# EAGLE schematic NES (EAGLE 9.6.2)
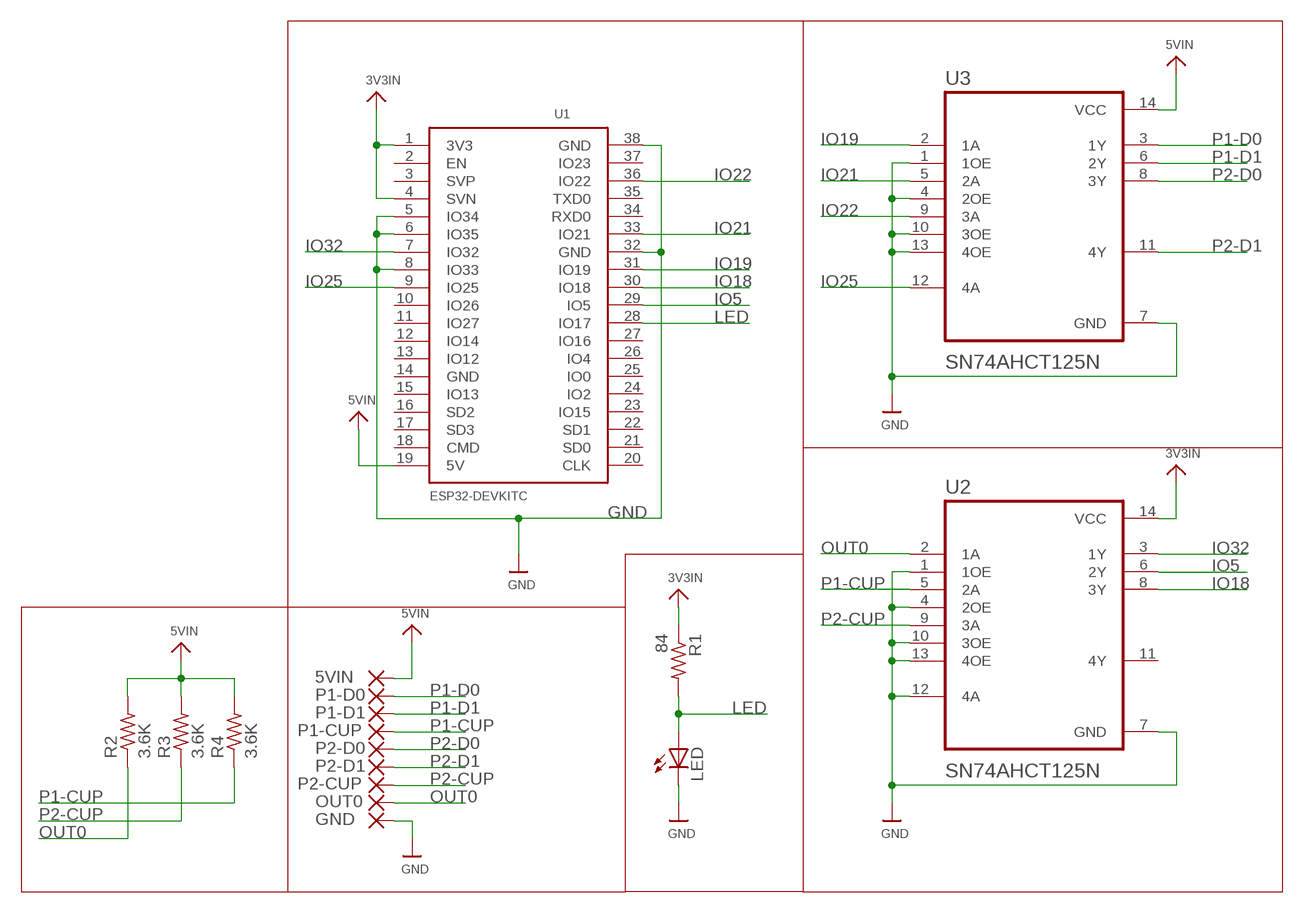
[diagram p0: schematic, sheet 1]

## Parts
5VIN  SMD5  [SMD2,54-5,08]
GND  SMD5  [SMD2,54-5,08]
LED  LEDCHIPLED_1206  [CHIPLED_1206]
OUT0  SMD5  [SMD2,54-5,08]
P1-CUP  SMD5  [SMD2,54-5,08]
P1-D0  SMD5  [SMD2,54-5,08]
P1-D1  SMD5  [SMD2,54-5,08]
P2-CUP  SMD5  [SMD2,54-5,08]
P2-D0  SMD5  [SMD2,54-5,08]
P2-D1  SMD5  [SMD2,54-5,08]
R1  84  R-US_R1206  [R1206]
R2  3.6K  R-US_R1206  [R1206]
R3  3.6K  R-US_R1206  [R1206]
R4  3.6K  R-US_R1206  [R1206]
U1  ESP32DEVKITC  [ESP32-DEVKITC]
U2  SN74AHCT125N  [DIP794W45P254L1969H508Q14]
U3  SN74AHCT125N  [DIP794W45P254L1969H508Q14]

## Nets
3V3IN: R1.1 U1.1(3V3) U1.4(SVN) U2.14(VCC)
5VIN: 5VIN.1(P) R2.2 R3.2 R4.2 U1.19(5V) U3.14(VCC)
GND: GND.1(P) LED.C U1.5(IO34) U1.6(IO35) U1.8(IO33) U1.32(GND) U1.38(GND) U2.1(1OE) U2.4(2OE) U2.7(GND) U2.10(3OE) U2.12(4A) U2.13(4OE) U3.1(1OE) U3.4(2OE) U3.7(GND) U3.10(3OE) U3.13(4OE)
IO5: U1.29(IO5) U2.6(2Y)
IO18: U1.30(IO18) U2.8(3Y)
IO19: U1.31(IO19) U3.2(1A)
IO21: U1.33(IO21) U3.5(2A)
IO22: U1.36(IO22) U3.9(3A)
IO25: U1.9(IO25) U3.12(4A)
IO32: U1.7(IO32) U2.3(1Y)
LED: LED.A R1.2 U1.28(IO17)
OUT0: OUT0.1(P) R2.1 U2.2(1A)
P1-CUP: P1-CUP.1(P) R4.1 U2.5(2A)
P1-D0: P1-D0.1(P) U3.3(1Y)
P1-D1: P1-D1.1(P) U3.6(2Y)
P2-CUP: P2-CUP.1(P) R3.1 U2.9(3A)
P2-D0: P2-D0.1(P) U3.8(3Y)
P2-D1: P2-D1.1(P) U3.11(4Y)
Unconnected: U1.2(EN) U1.3(SVP) U1.10(IO26) U1.11(IO27) U1.12(IO14) U1.13(IO12) U1.14(GND) U1.15(IO13) U1.16(SD2) U1.17(SD3) U1.18(CMD) U1.20(CLK) U1.21(SD0) U1.22(SD1) U1.23(IO15) U1.24(IO2) U1.25(IO0) U1.26(IO4) U1.27(IO16) U1.34(RXD0) U1.35(TXD0) U1.37(IO23) U2.11(4Y)

## Library data of the parts
5VIN GND OUT0 P1-CUP P1-D0 P1-D1 P2-CUP P2-D0 P2-D1 = wirepad:SMD5: SMD PAD
LED = adafruit:LED: LED OSRAM: - CHIPLED LG R971, LG N971, LY N971, LG Q971, LY Q971, LO R971, LY R971 LH N974, LH R974 LS Q976, LO Q976, LY Q976 LO Q996 - Hyper CHIPLED LW Q18S LB Q993, LB Q99A, LB R99A - SideLED LS A670, LO A670, LY A670, LG A670, LP A670 LB A673, LV A673, LT A673, LW A673 LH A674 LY A675 LS A676, LA A676, LO A676, LY A676, LW A676 LS A679, LY A679, LG A679 - Hyper Micro SIDELED® LS Y876, LA Y876, LO Y876, LY Y876 LT Y87S - SmartLED LW L88C, LW L88S LB L89C, LB L89S, LG L890 LS L89K, LO L89K, LY L89K LS L896, LA L896, LO L896, LY L896 - TOPLED LS T670, LO T670, LY T670, LG T670, LP T670 LSG T670, LSP T670, LSY T670, LOP T670, LYG T670 LG T671, LOG T671, LSG T671 LB T673, LV T673, LT T673, LW T673 LH T674 LS T676, LA T676, LO T676, LY T676, LB T676, LH T676, LSB T676, LW T676 LB T67C, LV T67C, LT T67C, LS T67K, LO T67K, LY T67K, LW E67C LS E67B, LA E67B, LO E67B, LY E67B, LB E67C, LV E67C, LT E67C LW T67C LS T679, LY T679, LG T679 LS T770, LO T770, LY T770, LG T770, LP T770 LB T773, LV T773, LT T773, LW T773 LH T774 LS E675, LA E675, LY E675, LS T675 LS T776, LA T776, LO T776, LY T776, LB T776 LHGB T686 LT T68C, LB T68C - Hyper Mini TOPLED® LB M676 - Mini TOPLED Santana® LG M470 LS M47K, LO M47K, LY M47K Source: http://www.osram.convergy.de/
R1-R4 = adafruit:R-US_: RESISTOR, American symbol
U1 = ESP32-DEVKITC:ESP32DEVKITC
U2 U3 = SN74AHCT125N:SN74AHCT125N: None Check prices <https://pricing.snapeda.com/parts/SN74AHCT125N/Texas%20Instruments/view-part?ref=eda>; AVAILABILITY: In Stock; DESCRIPTION: Quadruple Bus Buffer Gates With 3-State Outputs 14-PDIP -40 to 125; MF: Texas Instruments; MP: SN74AHCT125N; PACKAGE: PDIP-14 Texas Instruments; PRICE: None; PURCHASE-URL: https://pricing.snapeda.com/search/part/SN74AHCT125N/?ref=eda